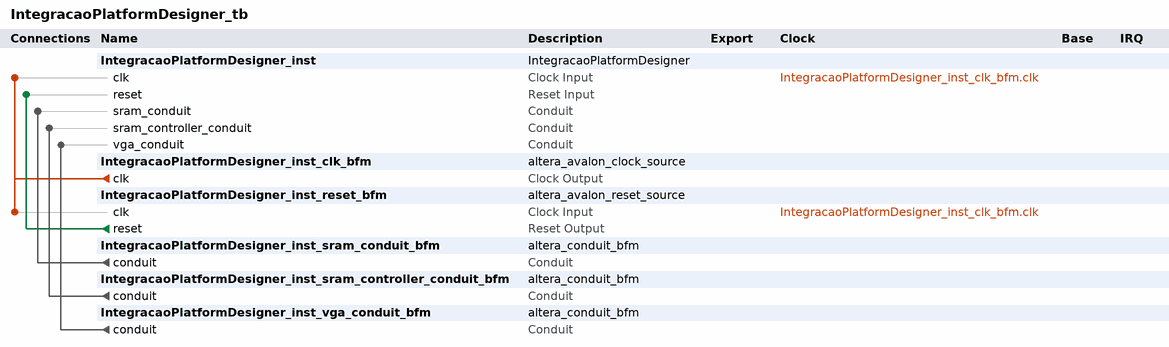
[diagram p0: system contents]
# Platform Designer (Qsys) system IntegracaoPlatformDesigner_tb, Cyclone IV E EP4CE115F29C7
# Parameters at their usual value, and those the tool derives, are not listed.
package require -exact qsys 20.1
create_system IntegracaoPlatformDesigner_tb
set_project_property DEVICE_FAMILY {Cyclone IV E}
set_project_property DEVICE EP4CE115F29C7

add_instance IntegracaoPlatformDesigner_inst IntegracaoPlatformDesigner 1.0

add_instance IntegracaoPlatformDesigner_inst_clk_bfm altera_avalon_clock_source 20.1

add_instance IntegracaoPlatformDesigner_inst_reset_bfm altera_avalon_reset_source 20.1
set_instance_parameter_value IntegracaoPlatformDesigner_inst_reset_bfm ASSERT_HIGH_RESET 0
set_instance_parameter_value IntegracaoPlatformDesigner_inst_reset_bfm INITIAL_RESET_CYCLES 50

add_instance IntegracaoPlatformDesigner_inst_sram_conduit_bfm altera_conduit_bfm 20.1
set_instance_parameter_value IntegracaoPlatformDesigner_inst_sram_conduit_bfm CLOCKED_SIGNAL false
set_instance_parameter_value IntegracaoPlatformDesigner_inst_sram_conduit_bfm ENABLE_RESET false
set_instance_parameter_value IntegracaoPlatformDesigner_inst_sram_conduit_bfm SIGNAL_DIRECTIONS output,output,output,bidir,output,output
set_instance_parameter_value IntegracaoPlatformDesigner_inst_sram_conduit_bfm SIGNAL_ROLES cdt_address,cdt_byteenable,cdt_chipselect,cdt_data_io,cdt_outputenable,cdt_write
set_instance_parameter_value IntegracaoPlatformDesigner_inst_sram_conduit_bfm SIGNAL_WIDTHS 20,2,1,16,1,1

add_instance IntegracaoPlatformDesigner_inst_sram_controller_conduit_bfm altera_conduit_bfm 20.1
set_instance_parameter_value IntegracaoPlatformDesigner_inst_sram_controller_conduit_bfm CLOCKED_SIGNAL false
set_instance_parameter_value IntegracaoPlatformDesigner_inst_sram_controller_conduit_bfm ENABLE_RESET false
set_instance_parameter_value IntegracaoPlatformDesigner_inst_sram_controller_conduit_bfm SIGNAL_DIRECTIONS input,input,bidir,input,input,input,input
set_instance_parameter_value IntegracaoPlatformDesigner_inst_sram_controller_conduit_bfm SIGNAL_ROLES ADDR,CE_N,DQ,LB_N,OE_N,UB_N,WE_N
set_instance_parameter_value IntegracaoPlatformDesigner_inst_sram_controller_conduit_bfm SIGNAL_WIDTHS 20,1,16,1,1,1,1

add_instance IntegracaoPlatformDesigner_inst_vga_conduit_bfm altera_conduit_bfm 20.1
set_instance_parameter_value IntegracaoPlatformDesigner_inst_vga_conduit_bfm CLOCKED_SIGNAL false
set_instance_parameter_value IntegracaoPlatformDesigner_inst_vga_conduit_bfm ENABLE_RESET false
set_instance_parameter_value IntegracaoPlatformDesigner_inst_vga_conduit_bfm SIGNAL_DIRECTIONS input,input,input,input,input,input,input,input
set_instance_parameter_value IntegracaoPlatformDesigner_inst_vga_conduit_bfm SIGNAL_ROLES B,BLANK,CLK,G,HS,R,SYNC,VS
set_instance_parameter_value IntegracaoPlatformDesigner_inst_vga_conduit_bfm SIGNAL_WIDTHS 8,1,1,8,1,8,1,1

# connections
add_connection IntegracaoPlatformDesigner_inst_clk_bfm.clk IntegracaoPlatformDesigner_inst.clk clock
add_connection IntegracaoPlatformDesigner_inst_clk_bfm.clk IntegracaoPlatformDesigner_inst_reset_bfm.clk clock
add_connection IntegracaoPlatformDesigner_inst_reset_bfm.reset IntegracaoPlatformDesigner_inst.reset reset
add_connection IntegracaoPlatformDesigner_inst_sram_conduit_bfm.conduit IntegracaoPlatformDesigner_inst.sram_conduit conduit
add_connection IntegracaoPlatformDesigner_inst_sram_controller_conduit_bfm.conduit IntegracaoPlatformDesigner_inst.sram_controller_conduit conduit
add_connection IntegracaoPlatformDesigner_inst_vga_conduit_bfm.conduit IntegracaoPlatformDesigner_inst.vga_conduit conduit

set_interconnect_requirement {$system} qsys_mm.clockCrossingAdapter HANDSHAKE
set_interconnect_requirement {$system} qsys_mm.enableEccProtection FALSE
set_interconnect_requirement {$system} qsys_mm.insertDefaultSlave FALSE
set_interconnect_requirement {$system} qsys_mm.maxAdditionalLatency 1

save_system IntegracaoPlatformDesigner_tb.qsys
